# Altium schematic sheet Ozgun_UKB.SchDoc
size A3; ApprovedBy: TEKNOFEST Komitesi; CheckedBy: TEKNOFEST Komitesi; SheetNumber: 2; SheetTotal: 2; ProjectDescription: Özgün Uçuş Kontrol Bilgisayarı; PreparedBy: Eren / Mehmet; RelaseDate: 27.01.2025; SheetSıze: A3
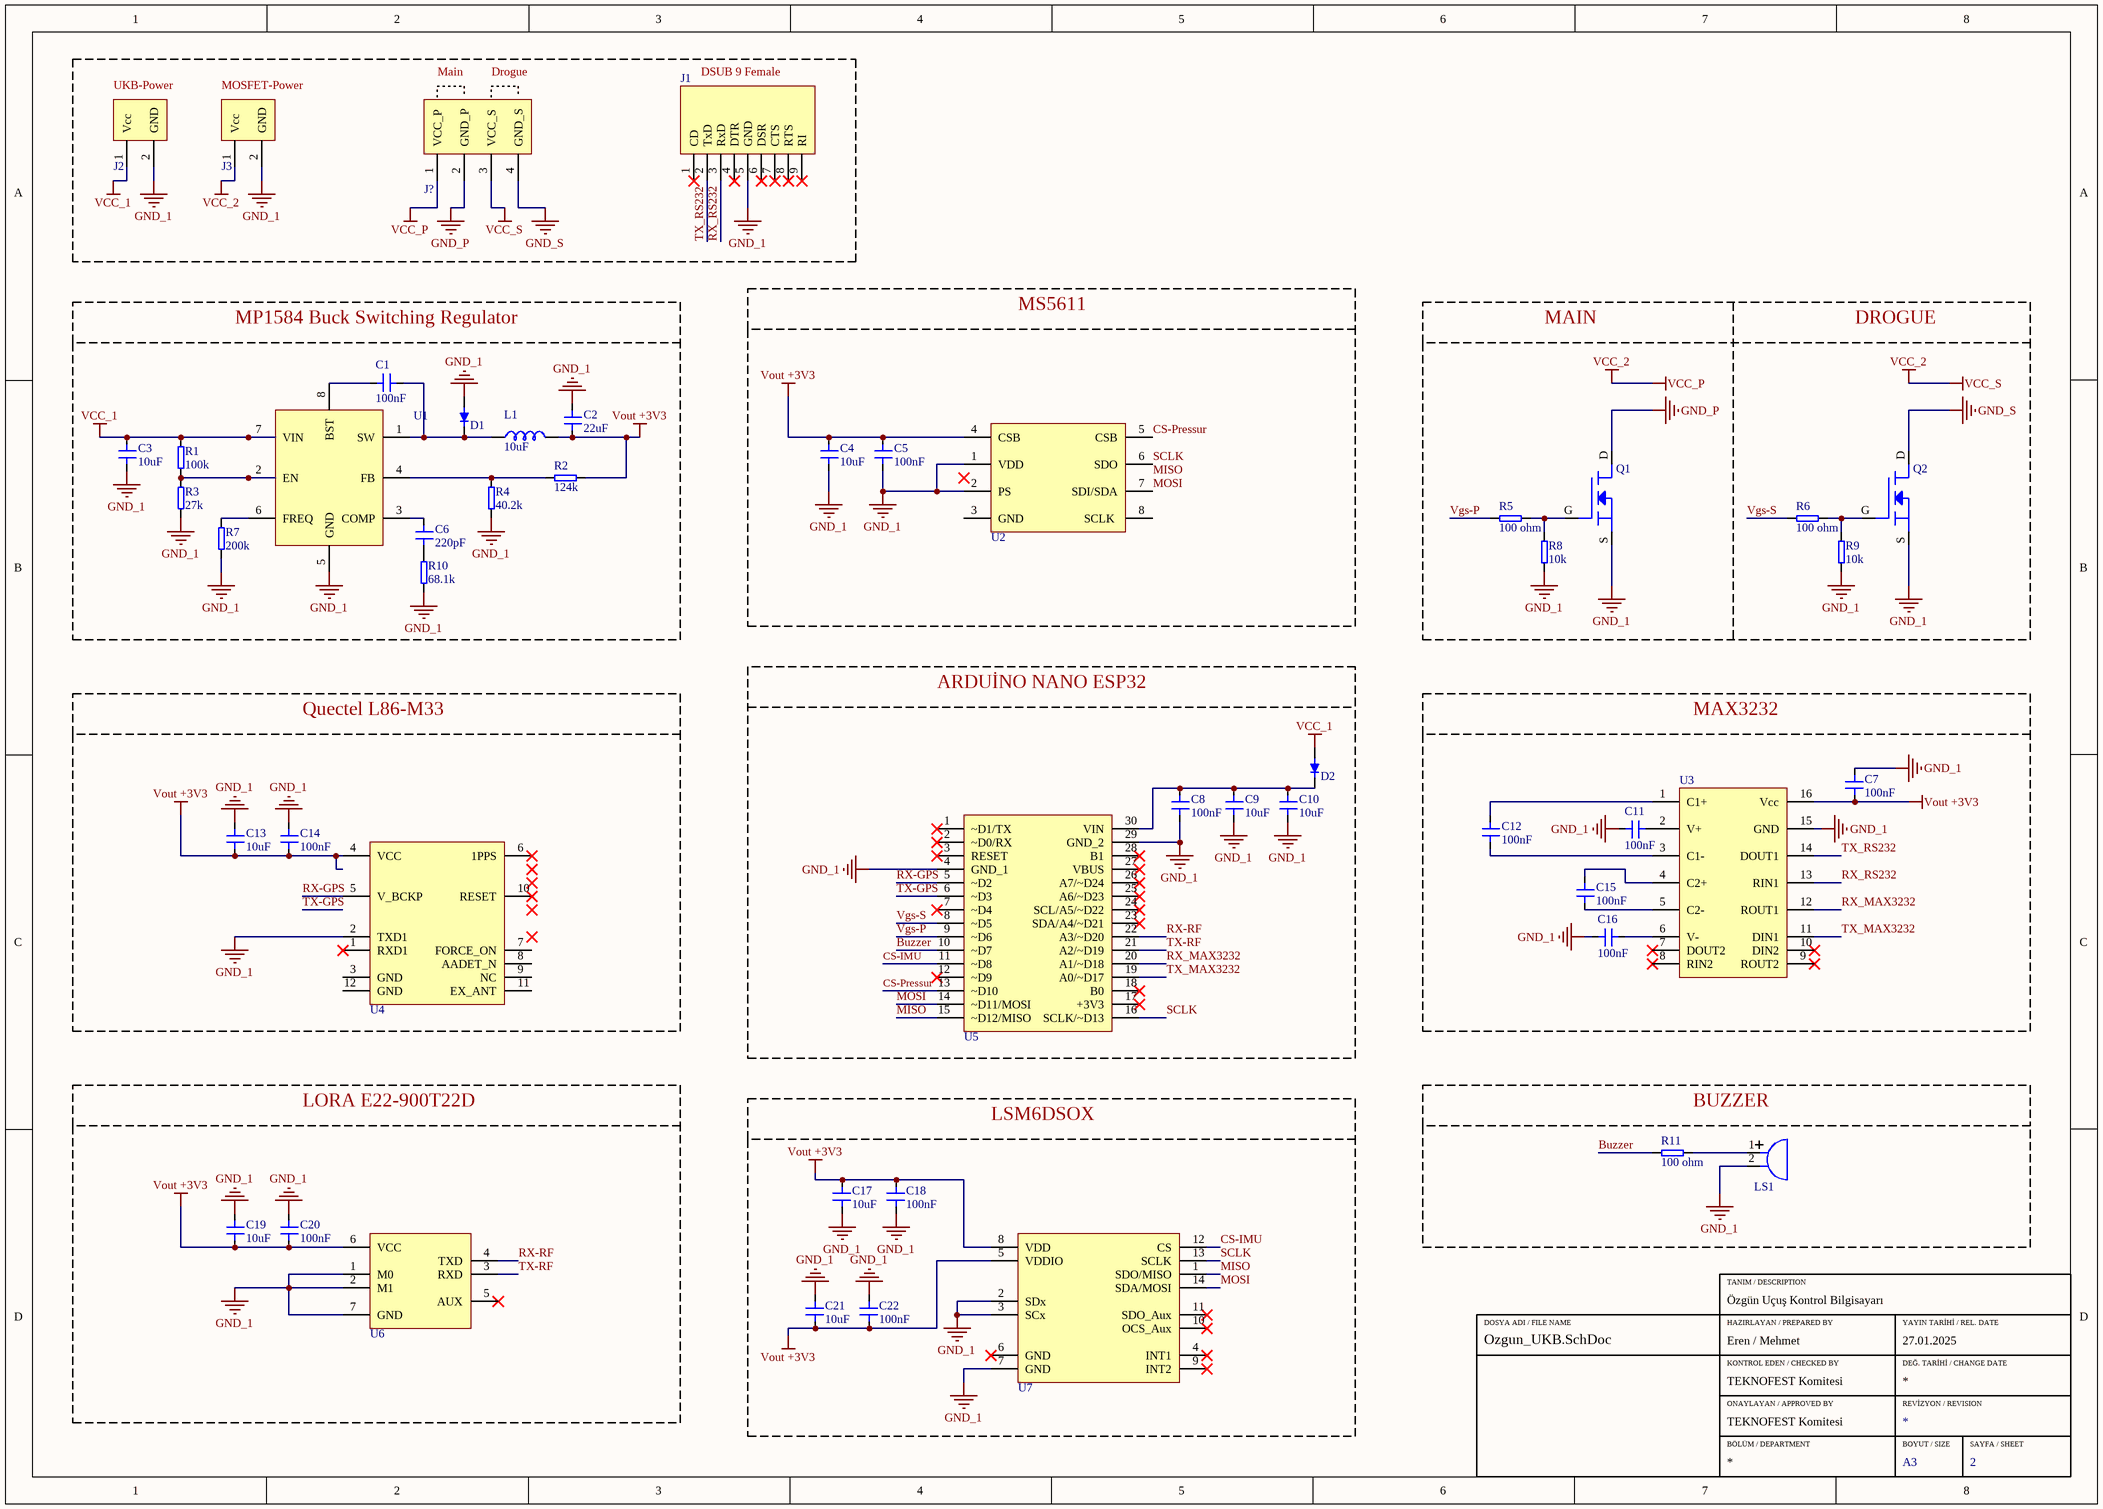
[diagram p0: Ozgun_UKB.SchDoc]

## Parts
C1  100nF  [0603 CAP SER]
C2  22uF  [1206 CAP SER]
C3  10uF  [0805 CAP SER]
C4  10uF  [0805 CAP SER]
C5  100nF  [0603 CAP SER]
C6  220pF  [0603 CAP SER]
C7  100nF  [0603 CAP SER]
C8  100nF  [0603 CAP SER]
C9  10uF  [0805 CAP SER]
C10  10uF  [0805 CAP SER]
C11  100nF  [0603 CAP SER]
C12  100nF  [0603 CAP SER]
C13  10uF  [0805 CAP SER]
C14  100nF  [0603 CAP SER]
C15  100nF  [0603 CAP SER]
C16  100nF  [0603 CAP SER]
C17  10uF  [0805 CAP SER]
C18  100nF  [0603 CAP SER]
C19  10uF  [0805 CAP SER]
C20  100nF  [0603 CAP SER]
C21  10uF  [0805 CAP SER]
C22  100nF  [0603 CAP SER]
D1  B340A-13-F  [DO-214AC SMA]  (value not drawn)
D2  B340A-13-F  [DO-214AC SMA]  (value not drawn)
J1  PDI-09S-5  [PDI-09R-5]  (value not drawn)
J2  2P Screw Terminal Block 2 pin  [2P Screw Terminal Block 2 pin]  (value not drawn)
J3  2P Screw Terminal Block 2 pin  [2P Screw Terminal Block 2 pin]  (value not drawn)
J?  DG125-5.0-04P-14-02AH  [4P SCREW TERMİNAL BLOCK]  (value not drawn)
L1  10uF  [İNDUCTOR 10uH]
LS1  YX-YT12075-YT03D  [BUZZER]  (value not drawn)
Q1  PJA3416AE_R1_00001  [SOT-23]  (value not drawn)
Q2  PJA3416AE_R1_00001  [SOT-23]  (value not drawn)
R1  100k  [0603 RES]
R2  124k  [0603 RES]
R3  27k  [0603 RES]
R4  40.2k  [0603 RES]
R5  100 ohm  [0603 RES]
R6  100 ohm  [0603 RES]
R7  200k  [0603 RES]
R8  10k  [0603 RES]
R9  10k  [0603 RES]
R10  68.1k  [0603 RES]
R11  100 ohm  [0603 RES]
U1  MP1584EN-LF-Z  [MP1584]  (value not drawn)
U2  MS5611-01BA03  [MS5611-01BA03]  (value not drawn)
U3  MAX3232IDWR  [SOIC-16W]  (value not drawn)
U4  L86-M33  [L86-M33]  (value not drawn)
U5  ABX00083  [ARDUİNO NANO ESP32]  (value not drawn)
U6  LORA E22-900T22D  [LORA E22-900T22D]  (value not drawn)
U7  LSM6DSOX  [LGA-14L]  (value not drawn)

## Blocks framed on the sheet
MP1584 Buck Switching Regulator: C1-C3 C6 D1 L1 R1-R4 R7 R10 U1
MS5611: C4 C5 U2
ARDUİNO NANO ESP32: C8-C10 D2 U5
Quectel L86-M33: C13 C14 U4
MAX3232: C7 C11 C12 C15 C16 U3
LORA E22-900T22D: C19 C20 U6
LSM6DSOX: C17 C18 C21 C22 U7
BUZZER: LS1 R11

## Nets
GND_1: C2.2 C3.1 C4.2 C5.2 C7.1 C8.1 C9.1 C10.1 C11.1 C13.2 C14.2 C16.1 C17.1 C18.1 C19.2 C20.2 C21.1 C22.1 D1.A J1.5(GND) J2.2(GND) J3.2(GND) LS1.2(-) Q1.S Q2.S R3.1 R4.1 R7.1 R8.1 R9.1 R10.1 U1.5(GND) U2.1(VDD) U2.2(PS) U3.15(GND) U4.2(TXD1) U5.4(GND_1) U5.29(GND_2) U6.1(M0) U6.2(M1) U6.7(GND) U7.2(SDx) U7.3(SCx) U7.7(GND)
GND_P: J?.2(GND_P) Q1.D
GND_S: J?.4(GND_S) Q2.D
VCC_1: C3.2 D2.A J2.1(Vcc) R1.2 U1.7(VIN)
VCC_2: J3.1(Vcc) J?.1(VCC_P) J?.3(VCC_S)  [also labelled VCC_P, VCC_S]
Vout +3V3: C2.1 C4.1 C5.1 C7.2 C13.1 C14.1 C17.2 C18.2 C19.1 C20.1 C21.2 C22.2 L1.2 R2.1 U2.4(CSB) U3.16(Vcc) U4.4(VCC) U6.6(VCC) U7.5(VDDIO) U7.8(VDD)
Buzzer: R11.1 U5.10(~D7)
CS-IMU: U5.11(~D8) U7.12(CS)
CS-Pressur: U2.5(CSB) U5.13(~D10)
MISO: U5.15(~D12/MISO) U7.1(SDO/MISO)
MOSI: U2.7(SDI/SDA) U5.14(~D11/MOSI) U7.14(SDA/MOSI)
RX-GPS: U4.5(V_BCKP) U5.5(~D2)
RX-RF: U5.22(A3/~D20) U6.4(TXD)
RX_MAX3232: U3.12(ROUT1) U5.20(A1/~D18)
RX_RS232: J1.3(RxD) U3.13(RIN1)
SCLK: U2.6(SDO) U5.16(SCLK/~D13) U7.13(SCLK)
TX-GPS: U5.6(~D3)
TX-RF: U5.21(A2/~D19) U6.3(RXD)
TX_MAX3232: U3.11(DIN1) U5.19(A0/~D17)
TX_RS232: J1.2(TxD) U3.14(DOUT1)
Vgs-P: R5.1 U5.9(~D6)
Vgs-S: R6.1 U5.8(~D5)
NetC1_1: C1.1 D1.K L1.1 U1.1(SW)
NetC1_2: C1.2 U1.8(BST)
NetC6_1: C6.1 R10.2
NetC6_2: C6.2 U1.3(COMP)
NetC8_2: C8.2 C9.2 C10.2 D2.K U5.30(VIN)
NetC11_2: C11.2 U3.2(V+)
NetC12_1: C12.1 U3.3(C1-)
NetC12_2: C12.2 U3.1(C1+)
NetC15_1: C15.1 U3.5(C2-)
NetC15_2: C15.2 U3.4(C2+)
NetC16_2: C16.2 U3.6(V-)
NetLS1_1: LS1.1(+) R11.2
NetQ1_G: Q1.G R5.2 R8.2
NetQ2_G: Q2.G R6.2 R9.2
NetR1_1: R1.1 R3.2 U1.2(EN)
NetR2_2: R2.2 R4.2 U1.4(FB)
NetR7_2: R7.2 U1.6(FREQ)

Not connected (* = marked no-connect by the designer): J1 1(CD)* 4(DTR)* 6(DSR)* 7(CTS)* 8(RTS)* 9(RI)*; U2 3(GND_) 8(SCLK_); U3 7(DOUT2)* 8(RIN2)* 9(ROUT2)* 10(DIN2)*; U4 1(RXD1)* 3(GND) 6(1PPS)* 7(FORCE_ON) 8(AADET_N) 9(NC) 10(RESET)* 11(EX_ANT) 12(GND); U5 1(~D1/TX)* 2(~D0/RX)* 3(RESET)* 7(~D4)* 12(~D9)* 17(+3V3)* 18(B0)* 23(SDA/A4/~D21)* 24(SCL/A5/~D22)* 25(A6/~D23)* 26(A7/~D24)* 27(VBUS)* 28(B1)*; U6 5(AUX)*; U7 4(INT1)* 6(GND)* 9(INT2)* 10(OCS_Aux)* 11(SDO_Aux)*

## Notes on the sheet
- (near J2) UKB-Power
- (near J3) MOSFET-Power
- Main
- Drogue
- DSUB 9 Female
- MAIN
- DROGUE
- Labels drawn without touching a wire or pin: MISO
- DOSYA ADI / FILE NAME
- TANIM / DESCRIPTION
- HAZIRLAYAN / PREPARED BY
- YAYIN TARİHİ / REL. DATE
- KONTROL EDEN / CHECKED BY
- DEĞ. TARİHİ / CHANGE DATE
- ONAYLAYAN / APPROVED BY
- BÖLÜM / DEPARTMENT
- REVİZYON / REVISION
- BOYUT / SIZE
- SAYFA / SHEET

## Library data of the parts
C1 C5 C7 C8 C11 C12 C14-C16 C18 C20 C22 = Cap Cer 0.1uF %10 SMD 0603: Ceramic Capacitor, Multilayer, Ceramic, 50V, 5% +Tol, 5% -Tol, X7R, 15% TC, 0.1uF, Surface Mount, 0603; Manufacturer: KEMET; Manufacturer Part Number: C0603C104J5RAC7867; Designed by: Eren/Mehmet; Multilayer: Yes; Supplier: Mouser; Supplier Part Number: 80-C0603C104J5R; RoHS: Yes; Category: Ceramic Capacitors; Stock: 477636; Pricing: 1=0,12, 10=0,049, 50=0,049, 100=0,029, 1000=0,027, 10000=0,01 (USD); Mounting Technology: Surface Mount; Case/Package: 0603; Pins: 2; Dielectric Material: Ceramic; Min Operating Temperature: -55°C; Max Operating Temperature: 125°C; Value: 100nF; Packaging: Tape and Reel; Termination: Wraparound; Length: 1.6mm; Width: 0.8mm; Height: 0.8mm; Reach SVHC Compliant: Yes; RoHS Compliant: Yes; ComponentLink1URL: https://datasheet.ciiva.com:443/pdfs/VipMasterIC/IC/KEME/KEME-S-A0008991654/KEME-S-A0008991654-1.pdf?src-supplier=IHS+Markit; ComponentLink1Description: Datasheet; ComponentLink2URL: https://datasheet.ciiva.com/28645/1851736-28645621.pdf?src-supplier=Element14; ComponentLink2Description: https://datasheet.ciiva.com/28645/1851736-28645621.pdf?src-supplier=Element14; ComponentLink3URL: https://datasheet.ciiva.com/46385/1851736-46385374.pdf?src-supplier=Element14; ComponentLink3Description: https://datasheet.ciiva.com/46385/1851736-46385374.pdf?src-supplier=Element14; ComponentLink4URL: https://datasheet.ciiva.com/46424/1851736-46424174.pdf?src-supplier=Element14; ComponentLink4Description: https://datasheet.ciiva.com/46424/1851736-46424174.pdf?src-supplier=Element14; ComponentLink5URL: https://datasheet.ciiva.com/18192/getdatasheetpartid-347940-18192678.pdf?src-supplier=Verical; ComponentLink5Description: https://datasheet.ciiva.com/18192/getdatasheetpartid-347940-18192678.pdf?src-supplier=Verical; Package Shape: Rectangular; Terminal Finish: Nickel; JESD-609 Code: e3; Capacitor Type: Ceramic; Tolerance  (fill in as +-): 5%; Package Style: SMTMeter; Tolerance (fill in as +-): 5%; Rated DC Voltage (URdc): 50V; Temperature Characteristics Code: X7R; ComponentLink6URL: https://datasheet.ciiva.com/18100/getdatasheetpartid-37078-18100981.pdf?src-supplier=Verical; ComponentLink6Description: https://datasheet.ciiva.com/18100/getdatasheetpartid-37078-18100981.pdf?src-supplier=Verical; ComponentLink7Description: Supplier; ComponentLink7URL: https://www.ozdisan.com/pasif-komponentler/kapasitorler/smt-smd-ve-mlcc-kapasitorler/C0603C104J5RAC7867/610231
C2 = Cap Cer 22uF %10 SMD 1206: Ceramic Capacitor, Multilayer, Ceramic, 10V, 10% +Tol, 10% -Tol, X7R, 15% TC, 22uF, Surface Mount, 1206; Manufacturer: Samsung; Manufacturer Part Number: CL31B226KPHNNNE; Designed by: Eren/Mehmet; Multilayer: Yes; Supplier: Mouser; Supplier Part Number: 187-CL31B226KPHNNNE; RoHS: Yes; Category: Ceramic Capacitors; Stock: 142217; Pricing: 1=0,38, 10=0,184, 50=0,184, 100=0,126, 1000=0,113, 10000=0,083 (USD); Mounting Technology: Surface Mount; Pins: 2; Dielectric Material: Ceramic; Package Shape: Rectangular; Case/Package: 1206; Terminal Finish: Nickel; Min Operating Temperature: -55°C; Max Operating Temperature: 125°C; Termination: Wraparound; JESD-609 Code: e3; Value: 22uF; Capacitor Type: Ceramic; Tolerance  (fill in as +-): 10%; Package Style: SMTMeter; Packaging: Tape and Reel; Tolerance (fill in as +-): 10%; Rated DC Voltage (URdc): 10V; Temperature Characteristics Code: X7R; Length: 3.2mm; Width: 1.6mm; Height: 1.8mm; Reach SVHC Compliant: Yes; RoHS Compliant: Yes; ComponentLink1URL: https://datasheet.ciiva.com:443/pdfs/VipMasterIC/IC/SEMS/SEMS-S-A0008384515/SEMS-S-A0008886067-1.pdf?src-supplier=IHS+Markit; ComponentLink1Description: Datasheet; ComponentLink2URL: https://datasheet.ciiva.com/25724/cl31b226kphnnne-25724443.pdf?src-supplier=Digikey; ComponentLink2Description: https://datasheet.ciiva.com/25724/cl31b226kphnnne-25724443.pdf?src-supplier=Digikey; ComponentLink3URL: https://datasheet.ciiva.com/16384/cl31b226kphnnne-16384588.pdf?src-supplier=Future+Electronics; ComponentLink3Description: https://datasheet.ciiva.com/16384/cl31b226kphnnne-16384588.pdf?src-supplier=Future+Electronics; ComponentLink4URL: https://datasheet.ciiva.com/26838/getdatasheetpartid-710483-26838941.pdf?src-supplier=Verical; ComponentLink4Description: https://datasheet.ciiva.com/26838/getdatasheetpartid-710483-26838941.pdf?src-supplier=Verical; ComponentLink5Description: Supplier; ComponentLink5URL: https://www.ozdisan.com/pasif-komponentler/kapasitorler/smt-smd-ve-mlcc-kapasitorler/CL31B226KPHNNNE/523424
C3 C4 C9 C10 C13 C17 C19 C21 = Cap Cer10uF %10 SMD 0805: Ceramic Capacitor, Multilayer, Ceramic, 16V, 10% +Tol, 10% -Tol, X7R, 15% TC, 10uF, Surface Mount, 0805; Manufacturer: Samsung; Manufacturer Part Number: CL21B106KOQNNNE; Designed by: Eren/Mehmet; Multilayer: Yes; Supplier: Mouser; Supplier Part Number: 187-CL21B106KOQNNNE; RoHS: Yes; Category: Ceramic Capacitors; Stock: 313805; Pricing: 1=0,18, 10=0,073, 50=0,073, 100=0,06, 1000=0,048, 10000=0,03 (USD); Mounting Technology: Surface Mount; Case/Package: 0805; Min Operating Temperature: -55°C; Max Operating Temperature: 125°C; Value: 10uF; Packaging: Tape and Reel; Termination: Wraparound; Length: 2mm; Width: 1.25mm; Height: 1.4mm; Reach SVHC Compliant: Yes; RoHS Compliant: Yes; ComponentLink1URL: https://datasheet.ciiva.com:443/pdfs/VipMasterIC/IC/SEMS/SEMS-S-A0008523115/SEMS-S-A0008523296-1.pdf?src-supplier=IHS+Markit; ComponentLink1Description: Datasheet; ComponentLink2URL: https://datasheet.ciiva.com/25794/cl21b106koqnnne-25794472.pdf?src-supplier=Digikey; ComponentLink2Description: https://datasheet.ciiva.com/25794/cl21b106koqnnne-25794472.pdf?src-supplier=Digikey; ComponentLink3URL: https://datasheet.ciiva.com/16428/cl21b106koqnnne-16428887.pdf?src-supplier=Future+Electronics; ComponentLink3Description: https://datasheet.ciiva.com/16428/cl21b106koqnnne-16428887.pdf?src-supplier=Future+Electronics; ComponentLink4URL: https://datasheet.ciiva.com/26920/getdatasheetpartid-355170-26920201.pdf?src-supplier=Verical; ComponentLink4Description: https://datasheet.ciiva.com/26920/getdatasheetpartid-355170-26920201.pdf?src-supplier=Verical; ComponentLink5URL: https://www.ozdisan.com/Product/Detail/355008/CL21B106KOQNNNE; ComponentLink5Description: Supplier; Pins: 2; Dielectric Material: Ceramic; Package Shape: Rectangular; Terminal Finish: Nickel; JESD-609 Code: e3; Capacitor Type: Ceramic; Tolerance  (fill in as +-): 10%; Package Style: SMTMeter; Tolerance (fill in as +-): 10%; Rated DC Voltage (URdc): 16V; Temperature Characteristics Code: X7R
C6 = Cap Cer 220pF %5 SMD 0603: Ceramic Capacitor, Multilayer, Ceramic, 50V, 5% +Tol, 5% -Tol, C0G, -/+30ppm/Cel TC, 0.00022uF, Surface Mount, 0603; Manufacturer: Samsung; Manufacturer Part Number: CL10C221JB8NNNC; Designed by: Eren/Mehmet; Multilayer: Yes; Supplier: Mouser; Supplier Part Number: 187-CL10C221JB8NNNC; RoHS: Yes; Category: Ceramic Capacitors; Stock: 90830; Pricing: 1=0,1, 10=0,015, 50=0,015, 100=0,012, 1000=0,009, 10000=0,005 (USD); Mounting Technology: Surface Mount; Case/Package: 0603; Min Operating Temperature: -55°C; Max Operating Temperature: 125°C; Packaging: Tape and Reel; Value: 220pF; Length: 1.6mm; Width: 0.8mm; Height: 0.9mm; RoHS Compliant: Yes; ComponentLink1URL: https://datasheet.ciiva.com:443/pdfs/VipMasterIC/IC/SEMS/SEMS-S-A0008520254/SEMS-S-A0008520266-1.pdf?src-supplier=IHS+Markit; ComponentLink1Description: Datasheet; Pins: 2; Dielectric Material: Ceramic; Package Shape: Rectangular; Terminal Finish: Nickel; JESD-609 Code: e3; Capacitor Type: Ceramic; Tolerance  (fill in as +-): 5%; Package Style: SMTMeter; Tolerance (fill in as +-): 5%; Rated DC Voltage (URdc): 50V; Temperature Characteristics Code: C0G; Termination: Wraparound; Reach SVHC Compliant: Yes; ComponentLink2URL: https://datasheet.ciiva.com/26838/getdatasheetpartid-355186-26838508.pdf?src-supplier=Verical; ComponentLink2Description: https://datasheet.ciiva.com/26838/getdatasheetpartid-355186-26838508.pdf?src-supplier=Verical; ComponentLink3URL: https://datasheet.ciiva.com/29198/456419-da-01-en-vs-kondensator-0603-29198975.pdf?src-supplier=Conrad; ComponentLink3Description: https://datasheet.ciiva.com/29198/456419-da-01-en-vs-kondensator-0603-29198975.pdf?src-supplier=Conrad; ComponentLink4Description: Supplier; ComponentLink4URL: https://www.ozdisan.com/pasif-komponentler/kapasitorler/smt-smd-ve-mlcc-kapasitorler/CL10C221JB8NNNC/337544
D1 D2 = B340A-13-F: Rectifier Diode, Schottky, 1 Phase, 1 Element, 3A, 40V V(RRM), Silicon; Manufacturer: Diodes; Package Body Material: Plastic; Application(s): EFFICIENCY; Forward Voltage: 500mV; Non-rep Pk Forward Current-Max: 80A; Number of Elements: 1; Time @ Peak Reflow Temperature-Max (s): 40s; Reference Standard: AEC-Q101; Qualification Status: Not Qualified; Designed by: Eren/Mehmet; Supplier: Mouser; Supplier Part Number: 621-B340A-F; Manufacturer Part Number: B340A-13-F; RoHS: Yes; Category: LDO; Stock: 117772; Pricing: 1=0,45, 10=0,283, 50=0,283, 100=0,199, 1000=0,128, 10000=0,091 (USD); Pins: 2; Package Shape: Rectangular; Diode Element Material: SILICON; Terminal Finish: Tin; Min Operating Temperature: -55°C; Max Operating Temperature: 125°C; JESD-30 Code: R-PDSO-C2; Max Output current: 3A; Package Style: SMALL OUTLINEMeter; Surface Mount: Yes; Technology: SCHOTTKY; Terminal Form: C BEND; Terminal Position: DUAL; JESD-609 Code: e3; Diode Type: RECTIFIER; Moisture Sensitivity Level: 1; Number of Phases: 1; Peak Reflow Temperature (Cel): 260°C; Rep Pk Reverse Voltage-Max: 40V; RoHS Compliant: Yes; Reach SVHC Compliant: No; ComponentLink1URL: https://datasheet.ciiva.com:443/pdfs/VipMasterIC/IC/DIOD/DIOD-S-A0002833665/DIOD-S-A0002833511-1.pdf?src-supplier=IHS+Markit; ComponentLink1Description: Datasheet; ComponentLink2URL: https://datasheet.ciiva.com/26949/getdatasheetpartid-143394-26949352.pdf?src-supplier=Verical; ComponentLink2Description: https://datasheet.ciiva.com/26949/getdatasheetpartid-143394-26949352.pdf?src-supplier=Verical; ComponentLink3URL: https://datasheet.ciiva.com/4245/861ds30891-4245763.pdf?src-supplier=Arrow+Electronics; ComponentLink3Description: https://datasheet.ciiva.com/4245/861ds30891-4245763.pdf?src-supplier=Arrow+Electronics; ComponentLink4URL: https://datasheet.ciiva.com/1177/ds30891-1177476.pdf?src-supplier=Element14; ComponentLink4Description: https://datasheet.ciiva.com/1177/ds30891-1177476.pdf?src-supplier=Element14; ComponentLink5URL: https://datasheet.ciiva.com/46393/1911813-46393773.pdf?src-supplier=Element14; ComponentLink5Description: https://datasheet.ciiva.com/46393/1911813-46393773.pdf?src-supplier=Element14; ComponentLink6URL: https://datasheet.ciiva.com/913/ds30891-913638.pdf?src-supplier=Digikey; ComponentLink6Description: https://datasheet.ciiva.com/913/ds30891-913638.pdf?src-supplier=Digikey; ComponentLink7URL: https://datasheet.ciiva.com/913/ds30891-913639.pdf?src-supplier=Digikey; ComponentLink7Description: https://datasheet.ciiva.com/913/ds30891-913639.pdf?src-supplier=Digikey; ComponentLink8URL: https://datasheet.ciiva.com/1240/ds30891-1240228.pdf?src-supplier=Newark; ComponentLink8Description: https://datasheet.ciiva.com/1240/ds30891-1240228.pdf?src-supplier=Newark; ComponentLink9URL: https://datasheet.ciiva.com/913/ds30891-913637.pdf?src-supplier=Digikey; ComponentLink9Description: https://datasheet.ciiva.com/913/ds30891-913637.pdf?src-supplier=Digikey; ComponentLink10Description: Supplier; ComponentLink10URL: https://ozdisan.com/guc-yari-iletkenleri/diyotlar-modul-diyotlar-ve-dogrultucular/schottky-diyotlar/B340A-13-F
J1 = PDI-09S-5: Right Angle, P.C.B., 5.0mm Footprint; ComponentLink1Description: Datasheet; ComponentLink1URL: https://datasheet.octopart.com/PDI-09S-Power-Dynamics-datasheet-12552829.pdf; ComponentLink2Description: Supplier; ComponentLink2URL: https://www.serelektronik.com.tr/urun/9-pin-pcb-tip-90-disi-d-sub-konnektor
J2 J3 = 2P Screw Terminal Block: Barrier Strip Terminal Block, 13.5A, 1.5mm2, 1 Row(s), 1 Deck(s); Manufacturer: Phoenix Contact; Manufacturer Part Number: 1729128; Voltage Rating: 400V; Wire/Cable Gauge: 16AWG; Number of Decks: 1; Number of Ways: 2; Safety Approval: CSA,CUL,CB,EAC; Supplier: Digikey; Supplier Part Number: 277-1247-ND; RoHS: Yes; Category: Terminal Blocks; Stock: 25195; Pricing: 1=1,2, 10=1,104, 50=1,058, 100=1,012, 250=0,9844, 500=0,92, 1000=0,8464, 2500=0,782, 5000=0,7475 (USD); Mounting Technology: Board; Number of Rows: 1; Current Rating: 13.5A; Reach SVHC Compliant: No; RoHS Compliant: Yes; ComponentLink1URL: https://datasheet.ciiva.com/16046/1729128-16046181.pdf?src-supplier=Onlinecomponents.com; ComponentLink1Description: https://datasheet.ciiva.com/16046/1729128-16046181.pdf?src-supplier=Onlinecomponents.com; ComponentLink2URL: https://datasheet.ciiva.com/15169/getdatasheetpartid-199310-15169845.pdf?src-supplier=Verical; ComponentLink2Description: https://datasheet.ciiva.com/15169/getdatasheetpartid-199310-15169845.pdf?src-supplier=Verical; ComponentLink3URL: https://datasheet.ciiva.com/823/1729128-823779.pdf?src-supplier=Digikey; ComponentLink3Description: https://datasheet.ciiva.com/823/1729128-823779.pdf?src-supplier=Digikey; ComponentLink4URL: https://datasheet.ciiva.com/14607/70054405-14607157.pdf?src-supplier=Allied+Electronics; ComponentLink4Description: https://datasheet.ciiva.com/14607/70054405-14607157.pdf?src-supplier=Allied+Electronics; ComponentLink5URL: https://datasheet.ciiva.com/29218/743664-da-01-en-printklemmenblock-mkdsn-1-5-2-5-08-29218154.pdf?src-supplier=Conrad; ComponentLink5Description: https://datasheet.ciiva.com/29218/743664-da-01-en-printklemmenblock-mkdsn-1-5-2-5-08-29218154.pdf?src-supplier=Conrad; ComponentLink6URL: https://datasheet.ciiva.com:443/pdfs/VipMasterIC/IC/ONST/ONST-S-A0002844216/ONST-S-A0002844216-1.pdf?src-supplier=IHS+Markit; ComponentLink6Description: https://datasheet.ciiva.com:443/pdfs/VipMasterIC/IC/ONST/ONST-S-A0002844216/ONST-S-A0002844216-1.pdf?src-supplier=IHS+Markit; ComponentLink7URL: https://datasheet.ciiva.com/825/osttcxx0162-825113.pdf?src-supplier=Digikey; ComponentLink7Description: https://datasheet.ciiva.com/825/osttcxx0162-825113.pdf?src-supplier=Digikey; ComponentLink8URL: https://datasheet.ciiva.com:443/pdfs/VipMasterIC/IC/PCON/PCON-S-A0008047989/PCON-S-A0008036843-1.pdf?src-supplier=IHS+Markit; ComponentLink8Description: https://datasheet.ciiva.com:443/pdfs/VipMasterIC/IC/PCON/PCON-S-A0008047989/PCON-S-A0008036843-1.pdf?src-supplier=IHS+Markit; Fastening Method: SCREW; Terminal and Terminal Block Type: BARRIER STRIP TERMINAL BLOCK; Wire Cross Section: 1.5mm2
J? = 4P Screw Terminal Block Kurtarma: TERM.BLK.5.00MM 4P PCB TYPE; Manufacturer: DEGSON; Designed by: Eren/Mehmet; Current Rating: 12.0A; Voltage Rating: 300V; Pitch: 5mm; ComponentLink1Description: Supplier; ComponentLink1URL: https://ozdisan.com/konnektor-ve-baglanti-elemanlari/klemensler/pcb-klemensler/DG125-5-0-04P-14-02AH/740966; Manufacturer Part Number: DG125-5.0-04P-14-02AH; ComponentLink2Description: Datasheet; ComponentLink2URL: https://cdn.ozdisan.com/ETicaret_Dosya/395451_1916554252..pdf
L1 = Inductor 10uH %20 SMD 7030: (SRP7030-100M) Inductor Power Shielded Wirewound 10uH 20% 100KHz Iron 3A 0.105Ohm DCR T/R; Manufacturer: Bourns; Designed by: Eren/Mehmet; Supplier: Mouser; Supplier Part Number: 652-SRP7030-100M; Manufacturer Part Number: SRP7030-100M; RoHS: Yes; Category: Fixed Inductors; Stock: 1581; Pricing: 1=1,21, 10=0,788, 50=0,788, 100=0,66, 1000=0,479, 10000=0,479 (USD); ComponentLink1URL: https://datasheet.ciiva.com/6689/srp7030-6689984.pdf?src-supplier=Digikey; ComponentLink1Description: https://datasheet.ciiva.com/6689/srp7030-6689984.pdf?src-supplier=Digikey; ComponentLink2URL: https://datasheet.ciiva.com/4955/srp7030-33303-4955889.pdf?src-supplier=Mouser; ComponentLink2Description: https://datasheet.ciiva.com/4955/srp7030-33303-4955889.pdf?src-supplier=Mouser; ComponentLink3URL: https://datasheet.ciiva.com/22704/1837085-22704151.pdf?src-supplier=Element14; ComponentLink3Description: https://datasheet.ciiva.com/22704/1837085-22704151.pdf?src-supplier=Element14; ComponentLink4URL: https://datasheet.ciiva.com/3868/42910260s8817865n1506-3868313.pdf?src-supplier=Arrow+Electronics; ComponentLink4Description: https://datasheet.ciiva.com/3868/42910260s8817865n1506-3868313.pdf?src-supplier=Arrow+Electronics; ComponentLink5URL: https://datasheet.ciiva.com/1074/srp7030-1074010.pdf?src-supplier=Digikey; ComponentLink5Description: https://datasheet.ciiva.com/1074/srp7030-1074010.pdf?src-supplier=Digikey; ComponentLink6URL: https://datasheet.ciiva.com/6689/srp7030-6689983.pdf?src-supplier=Digikey; ComponentLink6Description: https://datasheet.ciiva.com/6689/srp7030-6689983.pdf?src-supplier=Digikey; ComponentLink7URL: https://datasheet.ciiva.com/7849/1837085-7849564.pdf?src-supplier=Element14; ComponentLink7Description: https://datasheet.ciiva.com/7849/1837085-7849564.pdf?src-supplier=Element14; ComponentLink8URL: https://datasheet.ciiva.com/7399/1837085-7399627.pdf?src-supplier=Newark; ComponentLink8Description: https://datasheet.ciiva.com/7399/1837085-7399627.pdf?src-supplier=Newark; ComponentLink9Description: https://ozdisan.com/Product/Detail/483947/SRP7030-100M; ComponentLink9URL: https://ozdisan.com/Product/Detail/483947/SRP7030-100M
LS1 = Buzzer 2-5V: BUZZER MAGNETIC WITH CIRCUIT 3V 2.7-KHZ THT; Designed by: Eren/Mehmet; ComponentLink1Description: Datasheet; ComponentLink1URL: https://cdn.ozdisan.com/ETicaret_Dosya/499960_2479119.pdf; ComponentLink2Description: Suplier; ComponentLink2URL: https://ozdisan.com/elektromekanik-komponentler/ses-urunleri/buzzerlar/YX-YT12075-YT03D/483098
Q1 Q2 = PJA3416AE_R1_00001: MOSFET DIS.6.5A 20V N-CH SOT23 SMT; Manufacturer: Pan Jit; Designed by: Eren/Mehmet; Supplier: Mouser; Supplier Part Number: 241-PJA3416AER100001; Manufacturer Part Number: PJA3416AE_R1_00001; RoHS: No; Category: MOSFETs; Stock: 7147; Pricing: 1=0,29, 10=0,195, 50=0,195, 100=0,101, 1000=0,101, 10000=0,062 (USD); ComponentLink1Description: Datasheet; ComponentLink1URL: https://cdn.ozdisan.com/ETicaret_Dosya/601491_131509.pdf; ComponentLink2Description: Supplier; ComponentLink2URL: https://ozdisan.com/guc-yari-iletkenleri/mosfetler/discrete-mosfetler/PJA3416AER100001/601492
R1 = RES 100kOhm %5 SMD 0603: (RC0603JR-07100KL) SMD Chip Resistor, 100 kOhm, ï¿½ 5%, 100 mW, 0603 [1608 Metric], Thick Film, General Purpose; Manufacturer: Yageo; Value: 100kR; Temperature Coefficient: 100ppm/°C; Voltage Rating: 50V; Power Rating: 100mW; Designed by: Eren/Mehmet; Supplier: Mouser; Supplier Part Number: 603-RC0603JR-07100KL; Manufacturer Part Number: RC0603JR-07100KL; RoHS: Yes; Category: Chip SMD Resistors; Stock: 474748; Pricing: 1=0,11, 10=0,012, 50=0,012, 100=0,007, 1000=0,006, 10000=0,003 (USD); Case/Package: 0603; Pins: 2; Contact Plating: Tin,Matte; Case Code (Imperial): 0603; Case Code (Metric): 1608; Min Operating Temperature: -55°C; Max Operating Temperature: 155°C; Tolerance: 5%; Resistor Type: Thick Film; Packaging: Tape and Reel; Voltage Rating (DC): 50V; Termination: SMD/SMT; Features: Moisture Resistant; Series: RC; Max Power Dissipation: 100mW; Number of Terminations: 2; Resistance Tolerance: 5%; Voltage Rating (AC): 50V; Width: 0.8mm; Reach SVHC Compliant: No; Lead Free: Lead Free; RoHS Compliant: Yes; ComponentLink1URL: https://datasheet.ciiva.com/7983/443971-7983686.pdf?src-supplier=Element14; ComponentLink1Description: https://datasheet.ciiva.com/7983/443971-7983686.pdf?src-supplier=Element14; ComponentLink2URL: https://datasheet.ciiva.com/7746/443971-7746423.pdf?src-supplier=Element14; ComponentLink2Description: https://datasheet.ciiva.com/7746/443971-7746423.pdf?src-supplier=Element14; ComponentLink3URL: https://datasheet.ciiva.com/7746/443971-7746424.pdf?src-supplier=Element14; ComponentLink3Description: https://datasheet.ciiva.com/7746/443971-7746424.pdf?src-supplier=Element14; ComponentLink4URL: https://datasheet.ciiva.com/8887/pyu-rc0603-51-rohs-l-4-8887903.pdf?src-supplier=Avnet; ComponentLink4Description: https://datasheet.ciiva.com/8887/pyu-rc0603-51-rohs-l-4-8887903.pdf?src-supplier=Avnet; ComponentLink5Description: https://ozdisan.com/pasif-komponentler/direncler/smt-smd-ve-cip-direncler/RC0603JR-07100KL/497416; ComponentLink5URL: https://ozdisan.com/pasif-komponentler/direncler/smt-smd-ve-cip-direncler/RC0603JR-07100KL/497416
R2 = RES 124kOhm 1% SMD 0603: (CRCW0603124KFKEA) Res Thick Film 0603 124K Ohm 1% 0.1W(1/10W) ±100ppm/C Pad SMD T/R Automotive AEC-Q200; Manufacturer: Vishay; Voltage Rating (DC): 75V; Designed by: Eren/Mehmet; Supplier: Mouser; Supplier Part Number: 71-CRCW0603-124K-E3; Manufacturer Part Number: CRCW0603124KFKEA; RoHS: Yes; Category: Chip SMD Resistors; Stock: 45756; Pricing: 1=0,1, 10=0,015, 50=0,015, 100=0,01, 1000=0,008, 10000=0,004 (USD); Lead Free: 5697LeadFree; ComponentLink1URL: https://datasheet.ciiva.com/22706/1697337-22706234.pdf?src-supplier=Element14; ComponentLink1Description: https://datasheet.ciiva.com/22706/1697337-22706234.pdf?src-supplier=Element14; ComponentLink2URL: https://datasheet.ciiva.com/16758/70201119-16758287.pdf?src-supplier=Allied+Electronics; ComponentLink2Description: https://datasheet.ciiva.com/16758/70201119-16758287.pdf?src-supplier=Allied+Electronics; ComponentLink3URL: https://datasheet.ciiva.com/7792/125364-7792023.pdf?src-supplier=Element14; ComponentLink3Description: https://datasheet.ciiva.com/7792/125364-7792023.pdf?src-supplier=Element14; ComponentLink4Description: https://ozdisan.com/pasif-komponentler/direncler/smt-smd-ve-cip-direncler/CRCW0603124KFKEA/617319; ComponentLink4URL: https://ozdisan.com/pasif-komponentler/direncler/smt-smd-ve-cip-direncler/CRCW0603124KFKEA/617319
R3 = RES 27kOhm %5 SMD 0603: (RC0603JR-0727KL) SMD Chip Resistor, 27 kOhm, ï¿½ 5%, 100 mW, 0603 [1608 Metric], Thick Film, General Purpose; Manufacturer: Yageo; Voltage Rating (AC): 50V; Designed by: Eren/Mehmet; Supplier: Mouser; Supplier Part Number: 603-RC0603JR-0727KL; Manufacturer Part Number: RC0603JR-0727KL; RoHS: Yes; Category: Chip SMD Resistors; Stock: 94266; Pricing: 1=0,1, 10=0,009, 50=0,009, 100=0,006, 1000=0,005, 10000=0,002 (USD); Lead Free: 5697LeadFree; RoHS Compliant: 5897YesNo; ComponentLink1URL: https://datasheet.ciiva.com/2453/pyu-r-int-thick-7-2453217.pdf?src-supplier=Digikey; ComponentLink1Description: https://datasheet.ciiva.com/2453/pyu-r-int-thick-7-2453217.pdf?src-supplier=Digikey; ComponentLink2URL: https://datasheet.ciiva.com/2453/pyu-r-int-thick-7-2453218.pdf?src-supplier=Digikey; ComponentLink2Description: https://datasheet.ciiva.com/2453/pyu-r-int-thick-7-2453218.pdf?src-supplier=Digikey; ComponentLink3URL: https://datasheet.ciiva.com/2453/pyu-r-int-thick-7-2453219.pdf?src-supplier=Digikey; ComponentLink3Description: https://datasheet.ciiva.com/2453/pyu-r-int-thick-7-2453219.pdf?src-supplier=Digikey; ComponentLink4URL: https://datasheet.ciiva.com/7746/443971-7746477.pdf?src-supplier=Element14; ComponentLink4Description: https://datasheet.ciiva.com/7746/443971-7746477.pdf?src-supplier=Element14; ComponentLink5URL: https://datasheet.ciiva.com/7746/443971-7746478.pdf?src-supplier=Element14; ComponentLink5Description: https://datasheet.ciiva.com/7746/443971-7746478.pdf?src-supplier=Element14; ComponentLink6Description: https://ozdisan.com/pasif-komponentler/direncler/smt-smd-ve-cip-direncler/RC0603JR-0727KL/618090; ComponentLink6URL: https://ozdisan.com/pasif-komponentler/direncler/smt-smd-ve-cip-direncler/RC0603JR-0727KL/618090
R4 = RES 40.2kOhm %1 SMD 0603: (0603SAF4022T5E) Res, SMT, Thick Film, 40.2K Ohms, 50WV, 1% +/-tol, 0603 Case; Manufacturer: Multicomp; Manufacturer Part Number: MC0603SAF4022T5E; Voltage Rating (DC): 75V; Designed by: Eren/Mehmet; Supplier: Farnell; Supplier Part Number: 1646258; RoHS: Yes; Category: Resistors; Stock: 3394; Pricing: 1=0,103, 10=0,017, 100=0,014, 1000=0,011 (EUR); ComponentLink1URL: https://datasheet.ciiva.com/7376/1509465-7376504.pdf?src-supplier=Newark; ComponentLink1Description: https://datasheet.ciiva.com/7376/1509465-7376504.pdf?src-supplier=Newark; ComponentLink2URL: https://datasheet.ciiva.com/7776/ta-677-7776876.pdf?src-supplier=Element14; ComponentLink2Description: https://datasheet.ciiva.com/7776/ta-677-7776876.pdf?src-supplier=Element14; ComponentLink3Description: https://ozdisan.com/pasif-komponentler/direncler/smt-smd-ve-cip-direncler/0603SAF4022T5E/484013; ComponentLink3URL: https://ozdisan.com/pasif-komponentler/direncler/smt-smd-ve-cip-direncler/0603SAF4022T5E/484013
R5 R6 R11 = RES 0.1kOhm %5 SMD 0605: Fixed Resistor, Metal Glaze/thick Film, 0.1W, 100ohm, 75V, 5% +/-Tol, 100ppm/Cel, Surface Mount, 0603; Manufacturer: Yageo; Manufacturer Part Number: RC0603JR-07100RL; Designed by: Eren/Mehmet; Additional Feature: LASER TRIMMABLE; Power: 100mW; Rated Temperature: 70°C; Value: 100R; Temperature Coefficient (ppm/Cel): 100; Package Height: 0.45mm; Package Length: 1.6mm; Package Width: 0.8mm; Supplier: Mouser; Supplier Part Number: 603-RC0603JR-07100RL; RoHS: Yes; Category: Chip SMD Resistors; Stock: 219351; Pricing: 1=0,1, 10=0,008, 50=0,008, 100=0,007, 1000=0,005, 10000=0,002 (USD); Mounting Technology: Surface Mount; Pins: 2; Package Shape: Rectangular; Case/Package: 0603; Terminal Finish: Nickel; Min Operating Temperature: -55°C; Max Operating Temperature: 155°C; Tolerance: 5%; JESD-609 Code: e3; Resistor Type: FIXED RESISTOR; Construction: Chip; Packaging: Tape and Reel; Technology: METAL GLAZE/THICK FILM; Termination: Wraparound; Working Voltage: 75V; Reach SVHC Compliant: Yes; RoHS Compliant: Yes; ComponentLink1URL: https://datasheet.ciiva.com:443/pdfs/VipMasterIC/IC/YAGO/YAGO-S-A0008145938/YAGO-S-A0008145938-1.pdf?src-supplier=IHS+Markit; ComponentLink1Description: https://datasheet.ciiva.com:443/pdfs/VipMasterIC/IC/YAGO/YAGO-S-A0008145938/YAGO-S-A0008145938-1.pdf?src-supplier=IHS+Markit; ComponentLink2URL: https://datasheet.ciiva.com/7746/443971-7746425.pdf?src-supplier=Element14; ComponentLink2Description: https://datasheet.ciiva.com/7746/443971-7746425.pdf?src-supplier=Element14; ComponentLink3URL: https://datasheet.ciiva.com/7746/443971-7746426.pdf?src-supplier=Element14; ComponentLink3Description: https://datasheet.ciiva.com/7746/443971-7746426.pdf?src-supplier=Element14; ComponentLink4URL: https://datasheet.ciiva.com/15189/getdatasheetpartid-325207-15189846.pdf?src-supplier=Verical; ComponentLink4Description: https://datasheet.ciiva.com/15189/getdatasheetpartid-325207-15189846.pdf?src-supplier=Verical; ComponentLink5URL: https://datasheet.ciiva.com/8883/pyu-rc0603-51-rohs-l-4-8883047.pdf?src-supplier=Avnet; ComponentLink5Description: https://datasheet.ciiva.com/8883/pyu-rc0603-51-rohs-l-4-8883047.pdf?src-supplier=Avnet; ComponentLink6Description: Supplier; ComponentLink6URL: https://ozdisan.com/pasif-komponentler/direncler/smt-smd-ve-cip-direncler/RC0603JR-07100KL/497416
R7 = RES 200kOhm %1 SMD 0603: (0603SAF2003T5E) Res Thick Film 0603 200K Ohm 1% 0.1W(1/10W) ±100ppm/°C Pad SMD T/R; Manufacturer: Royal Electronic Factory; Designed by: Eren/Mehmet; ComponentLink1URL: https://datasheet.octopart.com/0603SAJ0204T5E-Royal-Ohm-datasheet-165785611.pdf?src-supplier=TME; ComponentLink1Description: https://datasheet.octopart.com/0603SAJ0204T5E-Royal-Ohm-datasheet-165785611.pdf?src-supplier=TME; ComponentLink2Description: https://ozdisan.com/pasif-komponentler/direncler/smt-smd-ve-cip-direncler/0603SAF2003T5E/339337; ComponentLink2URL: https://ozdisan.com/pasif-komponentler/direncler/smt-smd-ve-cip-direncler/0603SAF2003T5E/339337; Supplier: Mouser; Supplier Part Number: 303-0603SAF2003T5E; Manufacturer Part Number: 0603SAF2003T5E; RoHS: Yes; Stock: 170000; Pricing: 10000=0,001 (USD); ComponentLink3URL: https://datasheet.octopart.com/0603SAF2003T5E-Royal-Ohm-datasheet-165785611.pdf?src-supplier=TME; ComponentLink3Description: https://datasheet.octopart.com/0603SAF2003T5E-Royal-Ohm-datasheet-165785611.pdf?src-supplier=TME
R8 R9 = RES 10kOhm %5 SMD 0603: (RC0603JR-0710KL) SMD Chip Resistor, 10 kOhm, ï¿½ 5%, 100 mW, 0603 [1608 Metric], Thick Film, General Purpose; Manufacturer: Yageo; Value: 10kR; Temperature Coefficient: 100ppm/°C; Max Power Dissipation: 100mW; Voltage Rating (AC): 50V; Designed by: Eren/Mehmet; Supplier: Mouser; Supplier Part Number: 603-RC0603JR-0710KL; Manufacturer Part Number: RC0603JR-0710KL; RoHS: Yes; Category: Chip SMD Resistors; Stock: 1942230; Pricing: 1=0,1, 10=0,009, 50=0,009, 100=0,006, 1000=0,005, 10000=0,002 (USD); Case/Package: 0603; Min Operating Temperature: -55°C; Max Operating Temperature: 155°C; Tolerance: 5%; Number of Terminations: 2; Series: RC; Reach SVHC Compliant: 4187SVHC; Lead Free: 5697LeadFree; RoHS Compliant: Yes; ComponentLink1URL: https://datasheet.ciiva.com/2452/pyu-rc-group-51-rohs-l-10-2452848.pdf?src-supplier=Digikey; ComponentLink1Description: https://datasheet.ciiva.com/2452/pyu-rc-group-51-rohs-l-10-2452848.pdf?src-supplier=Digikey; ComponentLink2Description: https://ozdisan.com/pasif-komponentler/direncler/smt-smd-ve-cip-direncler/RC0603JR-0710KL/383150; ComponentLink2URL: https://ozdisan.com/pasif-komponentler/direncler/smt-smd-ve-cip-direncler/RC0603JR-0710KL/383150
R10 = RES 68.1kOhm %1 SMD 0603: (CRCW060368K1FKEA) CRCW Series 0603 0.1 W 68.1 kOhm ±1 % ±100 ppm/K SMT Thick Film Chip Resistor; Manufacturer: Vishay; Voltage Rating (DC): 75V; Designed by: Eren/Mehmet; Supplier: Mouser; Supplier Part Number: 71-CRCW0603-68.1K-E3; Manufacturer Part Number: CRCW060368K1FKEA; RoHS: Yes; Category: Chip SMD Resistors; Stock: 28030; Pricing: 1=0,1, 10=0,014, 50=0,014, 100=0,01, 1000=0,008, 10000=0,005 (USD); Lead Free: 5697LeadFree; ComponentLink1URL: https://datasheet.ciiva.com/11811/0900766b80d98afc-11811581.pdf?src-supplier=Rs; ComponentLink1Description: https://datasheet.ciiva.com/11811/0900766b80d98afc-11811581.pdf?src-supplier=Rs; ComponentLink2URL: https://datasheet.ciiva.com/8337/dcrcwe3-8337514.pdf?src-supplier=Avnet; ComponentLink2Description: https://datasheet.ciiva.com/8337/dcrcwe3-8337514.pdf?src-supplier=Avnet; ComponentLink3URL: https://datasheet.ciiva.com/3257/dcrcwe3-3257830.pdf?src-supplier=Avnet; ComponentLink3Description: https://datasheet.ciiva.com/3257/dcrcwe3-3257830.pdf?src-supplier=Avnet; ComponentLink4URL: https://datasheet.ciiva.com/16769/70201119-16769382.pdf?src-supplier=Allied+Electronics; ComponentLink4Description: https://datasheet.ciiva.com/16769/70201119-16769382.pdf?src-supplier=Allied+Electronics; ComponentLink5URL: https://datasheet.ciiva.com/22872/70201119-22872411.pdf?src-supplier=Allied+Electronics; ComponentLink5Description: https://datasheet.ciiva.com/22872/70201119-22872411.pdf?src-supplier=Allied+Electronics; ComponentLink6URL: https://datasheet.ciiva.com/7792/125364-7792376.pdf?src-supplier=Element14; ComponentLink6Description: https://datasheet.ciiva.com/7792/125364-7792376.pdf?src-supplier=Element14; ComponentLink7URL: https://datasheet.ciiva.com/5546/dcrcwe3-109170-5546238.pdf?src-supplier=Mouser; ComponentLink7Description: https://datasheet.ciiva.com/5546/dcrcwe3-109170-5546238.pdf?src-supplier=Mouser; ComponentLink8URL: https://datasheet.ciiva.com/22709/1697337-22709061.pdf?src-supplier=Element14; ComponentLink8Description: https://datasheet.ciiva.com/22709/1697337-22709061.pdf?src-supplier=Element14; ComponentLink9URL: https://datasheet.ciiva.com/16386/dcrcw-16386442.pdf?src-supplier=Future+Electronics; ComponentLink9Description: https://datasheet.ciiva.com/16386/dcrcw-16386442.pdf?src-supplier=Future+Electronics; ComponentLink10Description: https://ozdisan.com/pasif-komponentler/direncler/smt-smd-ve-cip-direncler/CRCW060368K1FKEA/467109; ComponentLink10URL: https://ozdisan.com/pasif-komponentler/direncler/smt-smd-ve-cip-direncler/CRCW060368K1FKEA/467109
U1 = MP1584 Regülatör: Buck Switching Regulator IC Positive Adjustable .8V 1 Output 3A 8-SOIC (.154", 3.9mm Width) Exposed Pad; Manufacturer: Monolithic Power Systems; Designed by: Eren/Mehmet; Max Power Dissipation: 2.5W; Max Supply Voltage: 28V; Min Supply Voltage: 4.5V; Nominal Supply Current: 100uA; Number of Channels: 1NUMBER; Supplier: Mouser; Supplier Part Number: 946-MP1584ENLFZ; Manufacturer Part Number: MP1584EN-LF-Z; RoHS: Yes; Category: Voltage Regulators - Switching; Stock: 443; Pricing: 1=3,59, 10=2,22, 50=2,22, 100=1,8, 1000=1,35, 10000=1,31 (USD); Height: 1.7mm; Lead Free: 5697LeadFree; ComponentLink1URL: http://www.mouser.com/ds/2/277/MP1584_r1.0-779241.pdf?src-supplier=Mouser; ComponentLink1Description: http://www.mouser.com/ds/2/277/MP1584_r1.0-779241.pdf?src-supplier=Mouser; ComponentLink2URL: https://datasheet.octopart.com/MP1584EN-LF-Z-Monolithic-Power-Systems-datasheet-26504489.pdf?src-supplier=Future+Electronics; ComponentLink2Description: https://datasheet.octopart.com/MP1584EN-LF-Z-Monolithic-Power-Systems-datasheet-26504489.pdf?src-supplier=Future+Electronics; ComponentLink3URL: https://www.monolithicpower.com/pub/media/document/MP1584_r1.0.pdf?src-supplier=Digikey; ComponentLink3Description: https://www.monolithicpower.com/pub/media/document/MP1584_r1.0.pdf?src-supplier=Digikey; ComponentLink4URL: http://www.monolithicpower.com/Portals/0/Documents/Products/Documents/datasheet/MP1584_r1.0.pdf?src-supplier=Digikey; ComponentLink4Description: http://www.monolithicpower.com/Portals/0/Documents/Products/Documents/datasheet/MP1584_r1.0.pdf?src-supplier=Digikey; ComponentLink5URL: https://datasheet.octopart.com/MP1584EN-LF-Z-Monolithic-Power-Systems-datasheet-157246321.pdf?src-supplier=LKR; ComponentLink5Description: https://datasheet.octopart.com/MP1584EN-LF-Z-Monolithic-Power-Systems-datasheet-157246321.pdf?src-supplier=LKR; ComponentLink6URL: https://datasheet.octopart.com/MP1584EN-LF-Z-Monolithic-Power-Systems-datasheet-155981995.pdf?src-supplier=Monolithic+Power+Systems; ComponentLink6Description: https://datasheet.octopart.com/MP1584EN-LF-Z-Monolithic-Power-Systems-datasheet-155981995.pdf?src-supplier=Monolithic+Power+Systems; ComponentLink7URL: https://datasheet.octopart.com/MP1584EN-LF-Z-Monolithic-Power-Systems-datasheet-28355791.pdf?src-supplier=SHENGYU+ELECTRONICS; ComponentLink7Description: https://datasheet.octopart.com/MP1584EN-LF-Z-Monolithic-Power-Systems-datasheet-28355791.pdf?src-supplier=SHENGYU+ELECTRONICS
U2 = MS5611: Pressure Sensor 1.44V to 3.6V 0.01bar to 1.2bar Absolute 8-Pin QFN T/R; Manufacturer: TE Connectivity; Manufacturer Part Number: MS561101BA03-50; Designed by: Eren/Mehmet; Output Type: SPI,I2C; Operating Pressure: 17.4PSI; Port Style: No Port; Max Pressure: 87.02PSI; ComponentLink1URL: http://www.farnell.com/datasheets/2917208.pdf?src-supplier=Farnell; ComponentLink1Description: http://www.farnell.com/datasheets/2917208.pdf?src-supplier=Farnell; ComponentLink2URL: http://www.farnell.com/datasheets/1756128.pdf?src-supplier=Newark; ComponentLink2Description: http://www.farnell.com/datasheets/1756128.pdf?src-supplier=Newark; ComponentLink3URL: https://www.te.com/commerce/DocumentDelivery/DDEController?Action=srchrtrv&DocNm=MS5611-01BA03&DocType=Data+Sheet&DocLang=English&src-supplier=Digikey; ComponentLink3Description: https://www.te.com/commerce/DocumentDelivery/DDEController?Action=srchrtrv&DocNm=MS5611-01BA03&DocType=Data+Sheet&DocLang=English&src-supplier=Digikey; ComponentLink4URL: https://datasheet.octopart.com/MS561101BA03-50-TE-Connectivity-datasheet-21074432.pdf?src-supplier=Element14; ComponentLink4Description: https://datasheet.octopart.com/MS561101BA03-50-TE-Connectivity-datasheet-21074432.pdf?src-supplier=Element14; ComponentLink5URL: https://datasheet.octopart.com/MS561101BA03-50-TE-Connectivity-datasheet-65793092.pdf?src-supplier=Future+Electronics; ComponentLink5Description: https://datasheet.octopart.com/MS561101BA03-50-TE-Connectivity-datasheet-65793092.pdf?src-supplier=Future+Electronics; ComponentLink6URL: https://datasheet.octopart.com/MS561101BA03-50-TE-Connectivity-datasheet-134530980.pdf?src-supplier=Master+Electronics; ComponentLink6Description: https://datasheet.octopart.com/MS561101BA03-50-TE-Connectivity-datasheet-134530980.pdf?src-supplier=Master+Electronics; Supplier: Mouser; Supplier Part Number: 824-MS561101BA03-50; RoHS: Yes; Category: Linear ICs; Pricing: 1=9,36, 10=8,23, 50=7,39, 100=6,27, 1000=5,83, 10000=5,78 (USD); Case/Package: SMD/SMT; Pins: 8; Min Operating Temperature: -40°C; Max Operating Temperature: 85°C; Operating Supply Voltage: 3.6V; Pressure Type: Absolute; Termination: SMD/SMT; Series: -; Packaging: Cut Tape; RoHS Compliant: Yes
U3 = MAX3232: Line Transceiver, 2 Func, 2 Driver, 2 Rcvr, SOIC-16W; Manufacturer: Texas Instruments; Package Body Material: Plastic; Differential Output: No; Driver Number of Bits: 2; High Level Input Current-Max: 1uA; Input Characteristics: SCHMITT TRIGGER; Out Swing-Min: 10V; Output Low Current-Max: 1.6mA; Package Equivalence Code: SOP16,.4; Power Supplies: 3.3/5V; Receive Delay-Max: 0ns; Max Supply Current: 1mA; Max Supply Voltage: 3.6V; Min Supply Voltage: 3V; Nominal Supply Voltage: 3.3V; Qualification Status: Not Qualified; Supplier: Mouser; Supplier Part Number: 595-MAX3232IDWR; Manufacturer Part Number: MAX3232IDWR; RoHS: Yes; Category: Interface ICs; Stock: 2547; Pricing: 1=1,3, 10=0,856, 50=0,856, 100=0,712, 1000=0,66, 10000=0,603 (USD); Case/Package: SOP; Pins: 16; Package Shape: Rectangular; Terminal Finish: Tin; Min Operating Temperature: -40°C; Max Operating Temperature: 85°C; JESD-609 Code: e3; Interface IC Type: LINE TRANSCEIVER; JESD-30 Code: R-PDSO-G16; Moisture Sensitivity Level: 1; Channels: 2; Package Style: SMALL OUTLINEMeter; Peak Reflow Temperature (Cel): 260°C; Receiver Number of Bits: 2; Surface Mount: Yes; Terminal Form: Gull Wing; Terminal Position: DUAL; Length: 10.3mm; Width: 7.5mm; Height - Seated (Max): 2.65mm; Terminal Pitch: 1.27mm; Temperature Grade: INDUSTRIAL; Reach SVHC Compliant: Yes; RoHS Compliant: Yes; ComponentLink1URL: https://www.ti.com:443/lit/ds/symlink/max3232.pdf?src-supplier=IHS+Markit; ComponentLink1Description: https://www.ti.com:443/lit/ds/symlink/max3232.pdf?src-supplier=IHS+Markit; ComponentLink2URL: https://datasheet.ciiva.com/1704/max3232-1704785.pdf?src-supplier=Digikey; ComponentLink2Description: Datasheet; ComponentLink3URL: https://datasheet.ciiva.com/1704/max3232-1704836.pdf?src-supplier=Digikey; ComponentLink3Description: https://datasheet.ciiva.com/1704/max3232-1704836.pdf?src-supplier=Digikey; ComponentLink4URL: https://datasheet.ciiva.com/1704/max3232-1704837.pdf?src-supplier=Digikey; ComponentLink4Description: https://datasheet.ciiva.com/1704/max3232-1704837.pdf?src-supplier=Digikey; ComponentLink5URL: https://datasheet.ciiva.com/15151/getdatasheetpartid-248506-15151866.pdf?src-supplier=Verical; ComponentLink5Description: https://datasheet.ciiva.com/15151/getdatasheetpartid-248506-15151866.pdf?src-supplier=Verical; ComponentLink6Description: Supplier; ComponentLink6URL: https://ozdisan.com/entegre-devreler-icler/interface-entegreleri/driver-receiver-ve-transceiver-entegreleri/MAX3232IDWR/379904
U4 = L86-M33: GLONASS/GPS/QZSS Module 18, 4x18, 4x6, 4mm SMD w/Antenna L86-M33; Manufacturer: Quectel Wireless Solutions; Designed by: Eren/Mehmet; Supplier: Mouser; Supplier Part Number: 277-L86-M33; Manufacturer Part Number: L86-M33; RoHS: Yes; Category: Connectors; Stock: 3077; Pricing: 1=15,26, 10=11,88, 50=10,54, 100=9,69, 1000=8,44, 10000=8,44 (USD); ComponentLink1URL: http://www.quectel.com/UploadFile/Product/Quectel_L86_GNSS_Specification_V1.0.pdf?src-supplier=Avnet; ComponentLink1Description: http://www.quectel.com/UploadFile/Product/Quectel_L86_GNSS_Specification_V1.0.pdf?src-supplier=Avnet; ComponentLink2URL: https://datasheet.octopart.com/L86-M33-Quectel-datasheet-163887215.pdf?src-supplier=SOS+electronic; ComponentLink2Description: https://datasheet.octopart.com/L86-M33-Quectel-datasheet-163887215.pdf?src-supplier=SOS+electronic
U5 = Arduino Nano ESP32: Nano Form Factor Board, NORA-W106-10B, 32bit, Xtensa LX7; Designed by: Eren/Mehmet; Supplier: Mouser; Supplier Part Number: 782-ABX00083; Manufacturer: Arduino; Manufacturer Part Number: ABX00083; RoHS: No; Stock: 1118; Pricing: 1=21, 10=21, 50=21, 100=21, 1000=21, 10000=21 (USD)
U6 = LORA E22-900T22D: Designed by: Eren/Mehmet; ComponentLink1Description: https://fixaj.com/e22-900t22d/; ComponentLink1URL: https://fixaj.com/e22-900t22d/
U7 = LSM6DSOX: LSM6DSOX: 3.6 V 3 Axis Accelerometer Gyroscope iNEMO Inertial Module - LGA-14L; Manufacturer: STMicroelectronics; Manufacturer Part Number: LSM6DSOXTR; Sensor Type: Accelerometer,Gyroscope,6 Axis; Output Type: SPI,I2C; Max Supply Voltage: 3.6V; Min Supply Voltage: 1.62V; Operating Supply Current: 550uA; Operating Supply Voltage: 1.8V; Designed by: Eren/Mehmet; Supplier: Mouser; Supplier Part Number: 511-LSM6DSOXTR; RoHS: Yes; Category: Inertial Measurement Units (IMUs); Stock: 8241; Pricing: 1=4,29, 10=3,49, 50=3,49, 100=2,96, 1000=2,76, 10000=2,54 (USD); Mounting Technology: Surface Mount; Case/Package: LGA; Min Operating Temperature: -40°C; Max Operating Temperature: 85°C; Series: iNEMO; Packaging: Cut Tape; Height: 860um; ComponentLink1URL: http://www.farnell.com/datasheets/2736724.pdf?src-supplier=Farnell; ComponentLink1Description: http://www.farnell.com/datasheets/2736724.pdf?src-supplier=Farnell; ComponentLink2URL: https://www.st.com/resource/en/datasheet/lsm6dsox.pdf?src-supplier=Digikey; ComponentLink2Description: https://www.st.com/resource/en/datasheet/lsm6dsox.pdf?src-supplier=Digikey